# EAGLE design Pyro_Cut-Down (EAGLE 9.2.2)

## Sheet 1 of 2
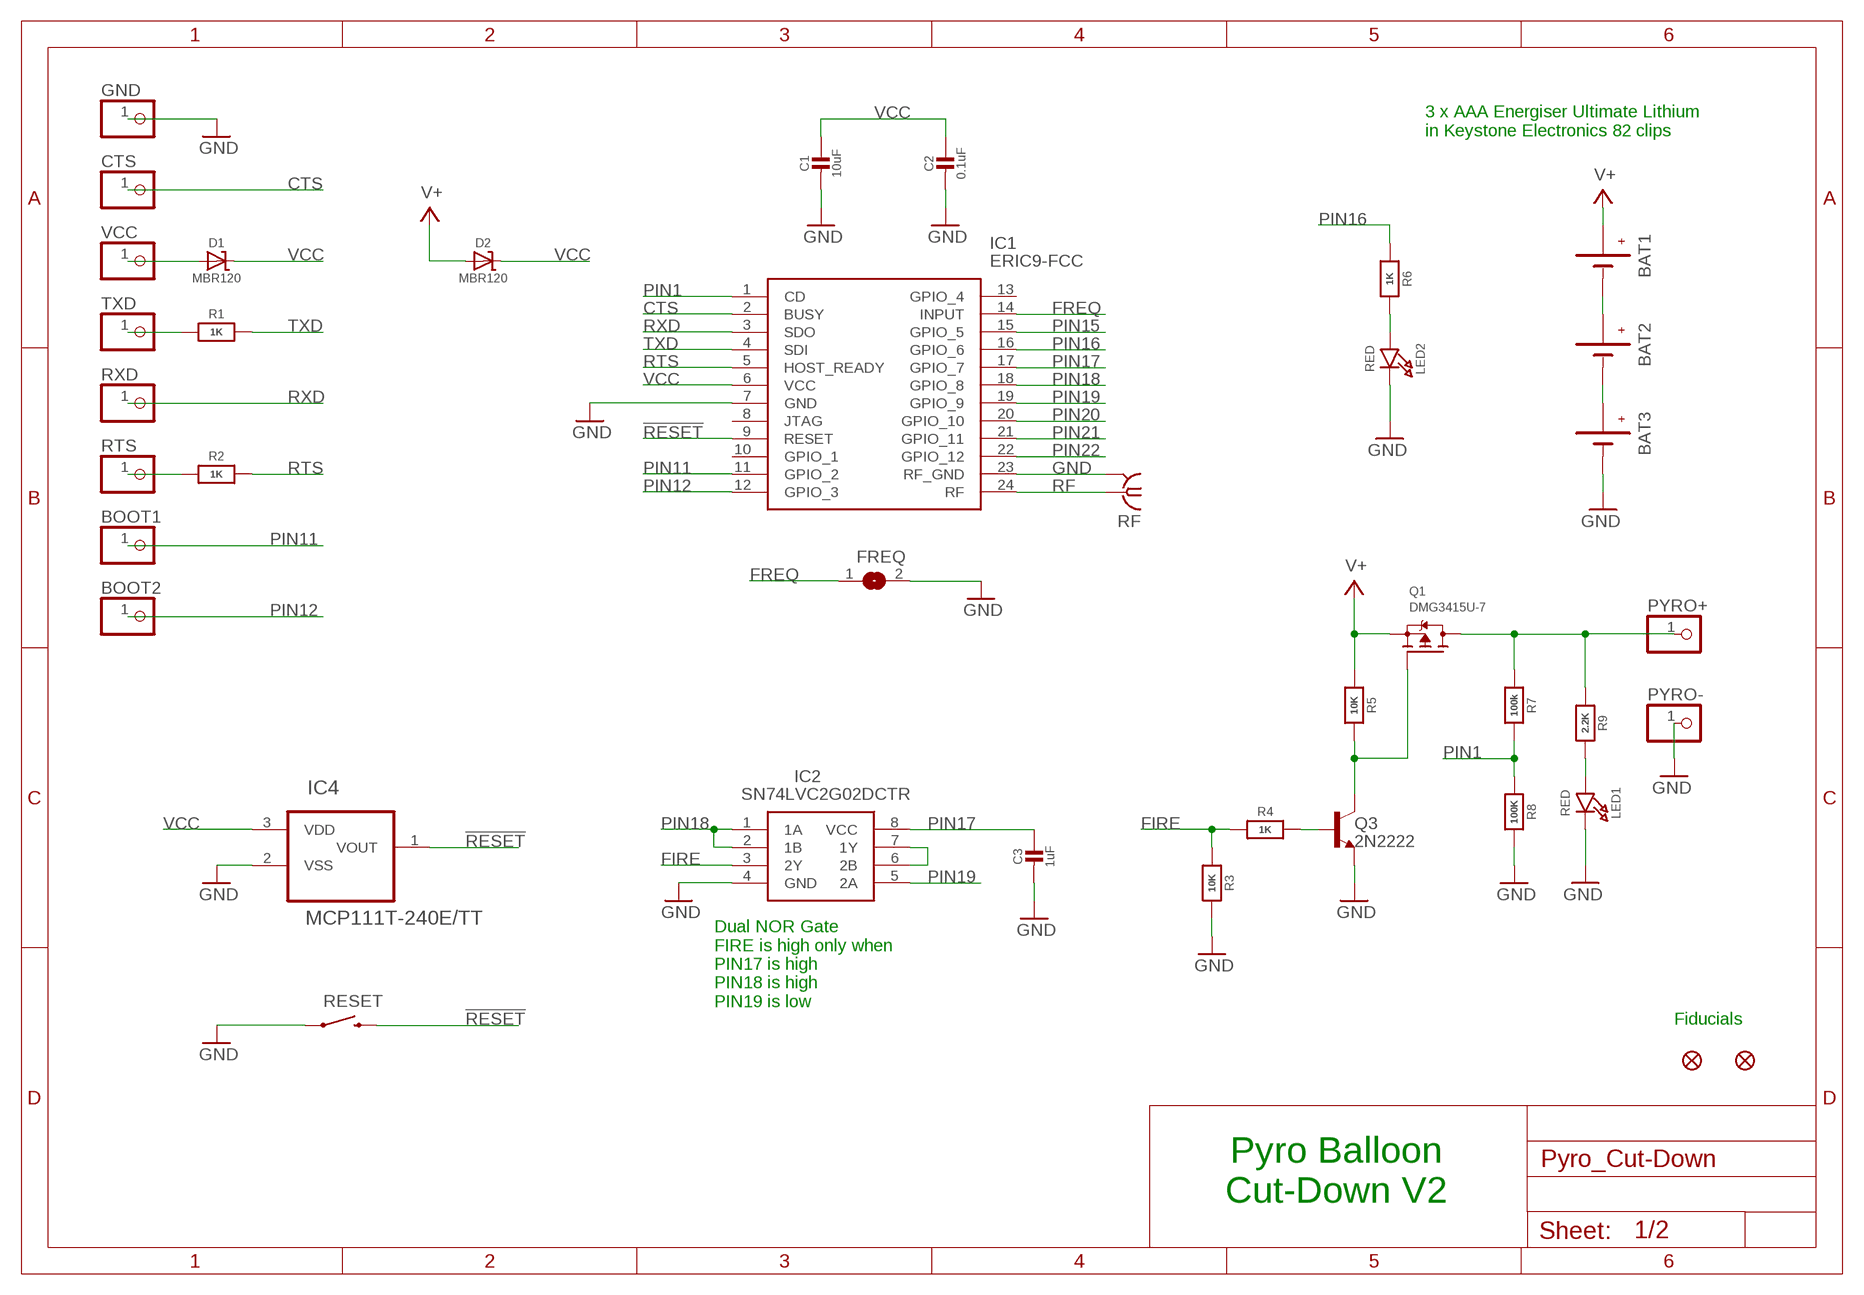
[diagram p0: schematic, sheet 1]

### Parts
BAT1  BATTERYKEYSTONE82  [BATTERY-AAA-KEYSTONE82]
BAT2  BATTERYKEYSTONE82  [BATTERY-AAA-KEYSTONE82]
BAT3  BATTERYKEYSTONE82  [BATTERY-AAA-KEYSTONE82]
BOOT1  PINHD-1X1  [1X01]
BOOT2  PINHD-1X1  [1X01]
C1  10uF  CAP_CERAMIC0805-NOOUTLINE  [0805-NO]
C2  0.1uF  CAP_CERAMIC0603_NO  [0603-NO]
C3  1uF  CAP_CERAMIC0603_NO  [0603-NO]
CTS  PINHD-1X1  [1X01]
D1  MBR120  DIODE-SCHOTTKYSOD-123  [SOD-123]
D2  MBR120  DIODE-SCHOTTKYSOD-123  [SOD-123]
FD1  FIDUCIAL1X2  [FIDUCIAL-1X2]
FD2  FIDUCIAL1X2  [FIDUCIAL-1X2]
FREQ  SOLDERJUMPER  [SOLDERJUMPER_ARROW_NOPASTE]
GND  PINHD-1X1  [1X01]
IC1  ERIC9-FCC  [ERIC4]
IC2  SN74LVC2G02DCTR  [SOP65P400X130-8N]
IC4  MCP111T-240E/TT  MCP111T-270E/TT  [SOT95P237X112-3N]
LED1  RED  LED0805_NOOUTLINE  [CHIPLED_0805_NOOUTLINE]
LED2  RED  LED0805_NOOUTLINE  [CHIPLED_0805_NOOUTLINE]
PYRO+  PINHD-1X1  [1X01]
PYRO-  PINHD-1X1  [1X01]
Q1  DMG3415U-7  MOSFET-PWIDE  [SOT23-WIDE]
Q3  2N2222  MMBT2222ALT1-NPN-SOT23-BEC  [SOT23-BEC]
R1  1K  RESISTOR_0603_NOOUT  [0603-NO]
R2  1K  RESISTOR_0603_NOOUT  [0603-NO]
R3  10K  RESISTOR_0603_NOOUT  [0603-NO]
R4  1K  RESISTOR_0603_NOOUT  [0603-NO]
R5  10K  RESISTOR_0603_NOOUT  [0603-NO]
R6  1K  RESISTOR_0603_NOOUT  [0603-NO]
R7  100k  RESISTOR_0603_NOOUT  [0603-NO]
R8  100K  RESISTOR_0603_NOOUT  [0603-NO]
R9  2.2K  RESISTOR_0603_NOOUT  [0603-NO]
RESET  SWITCH-MOMENTARY-2PTH  [TACTILE-PTH]
RF  SMA-142-0711-821/826  [J502-ND-142-0711-821/826]
RTS  PINHD-1X1  [1X01]
RXD  PINHD-1X1  [1X01]
TXD  PINHD-1X1  [1X01]
VCC  PINHD-1X1  [1X01]

### Nets
!RESET: IC1.9(RESET) IC4.1(VOUT) RESET.3 ; also sheet 2
CTS: CTS.1 IC1.2(BUSY)
FIRE: IC2.3(2Y) R3.1 R4.1
FREQ: FREQ.1 IC1.14(INPUT)
GND: BAT3.GND@1(-) BAT3.GND@2(-) C1.2 C2.2 C3.2 FREQ.2 GND.1 IC1.7(GND) IC1.23(RF_GND) IC2.4(GND) IC4.2(VSS) LED1.C LED2.C PYRO-.1 Q3.E R3.2 R8.2 RESET.1 RF.G@1 RF.G@2 RF.G@3 RF.G@4 ; also sheet 2
N$1: BAT2.GND@1(-) BAT2.GND@2(-) BAT3.PWR@1(+) BAT3.PWR@2(+)
N$2: LED2.A R6.2
N$3: BAT1.GND@1(-) BAT1.GND@2(-) BAT2.PWR@1(+) BAT2.PWR@2(+)
N$4: LED1.A R9.2
N$5: R1.1 TXD.1
N$6: IC2.6(2B) IC2.7(1Y)
N$7: R2.1 RTS.1
N$9: D1.A VCC.1
N$19: Q1.1(G) Q3.C R5.2
N$20: Q3.B R4.2
PIN1: IC1.1(CD) R7.2 R8.1
PIN11: BOOT1.1 IC1.11(GPIO_2)
PIN12: BOOT2.1 IC1.12(GPIO_3)
PIN15: IC1.15(GPIO_5) ; also sheet 2
PIN16: IC1.16(GPIO_6) R6.1
PIN17: C3.1 IC1.17(GPIO_7) IC2.8(VCC)
PIN18: IC1.18(GPIO_8) IC2.1(1A) IC2.2(1B)
PIN19: IC1.19(GPIO_9) IC2.5(2A)
PIN20: IC1.20(GPIO_10) ; also sheet 2
PIN21: IC1.21(GPIO_11) ; also sheet 2
PIN22: IC1.22(GPIO_12)
PYRO: PYRO+.1 Q1.3(D) R7.1 R9.1
RF: IC1.24(RF) RF.1
RTS: IC1.5(HOST_READY) R2.2
RXD: IC1.3(SDO) RXD.1
TXD: IC1.4(SDI) R1.2
V+: BAT1.PWR@1(+) BAT1.PWR@2(+) D2.A Q1.2(S) R5.1
VCC: C1.1 C2.1 D1.C D2.C IC1.6(VCC) IC4.3(VDD) ; also sheet 2
Unconnected: IC1.8(JTAG) IC1.10(GPIO_1) IC1.13(GPIO_4)

### Notes on the sheet
- 3 x AAA Energiser Ultimate Lithium
  in Keystone Electronics 82 clips
- Dual NOR Gate
  FIRE is high only when
  PIN17 is high
  PIN18 is high
  PIN19 is low
- Fiducials
- Pyro Balloon
  Cut-Down V2

## Sheet 2 of 2
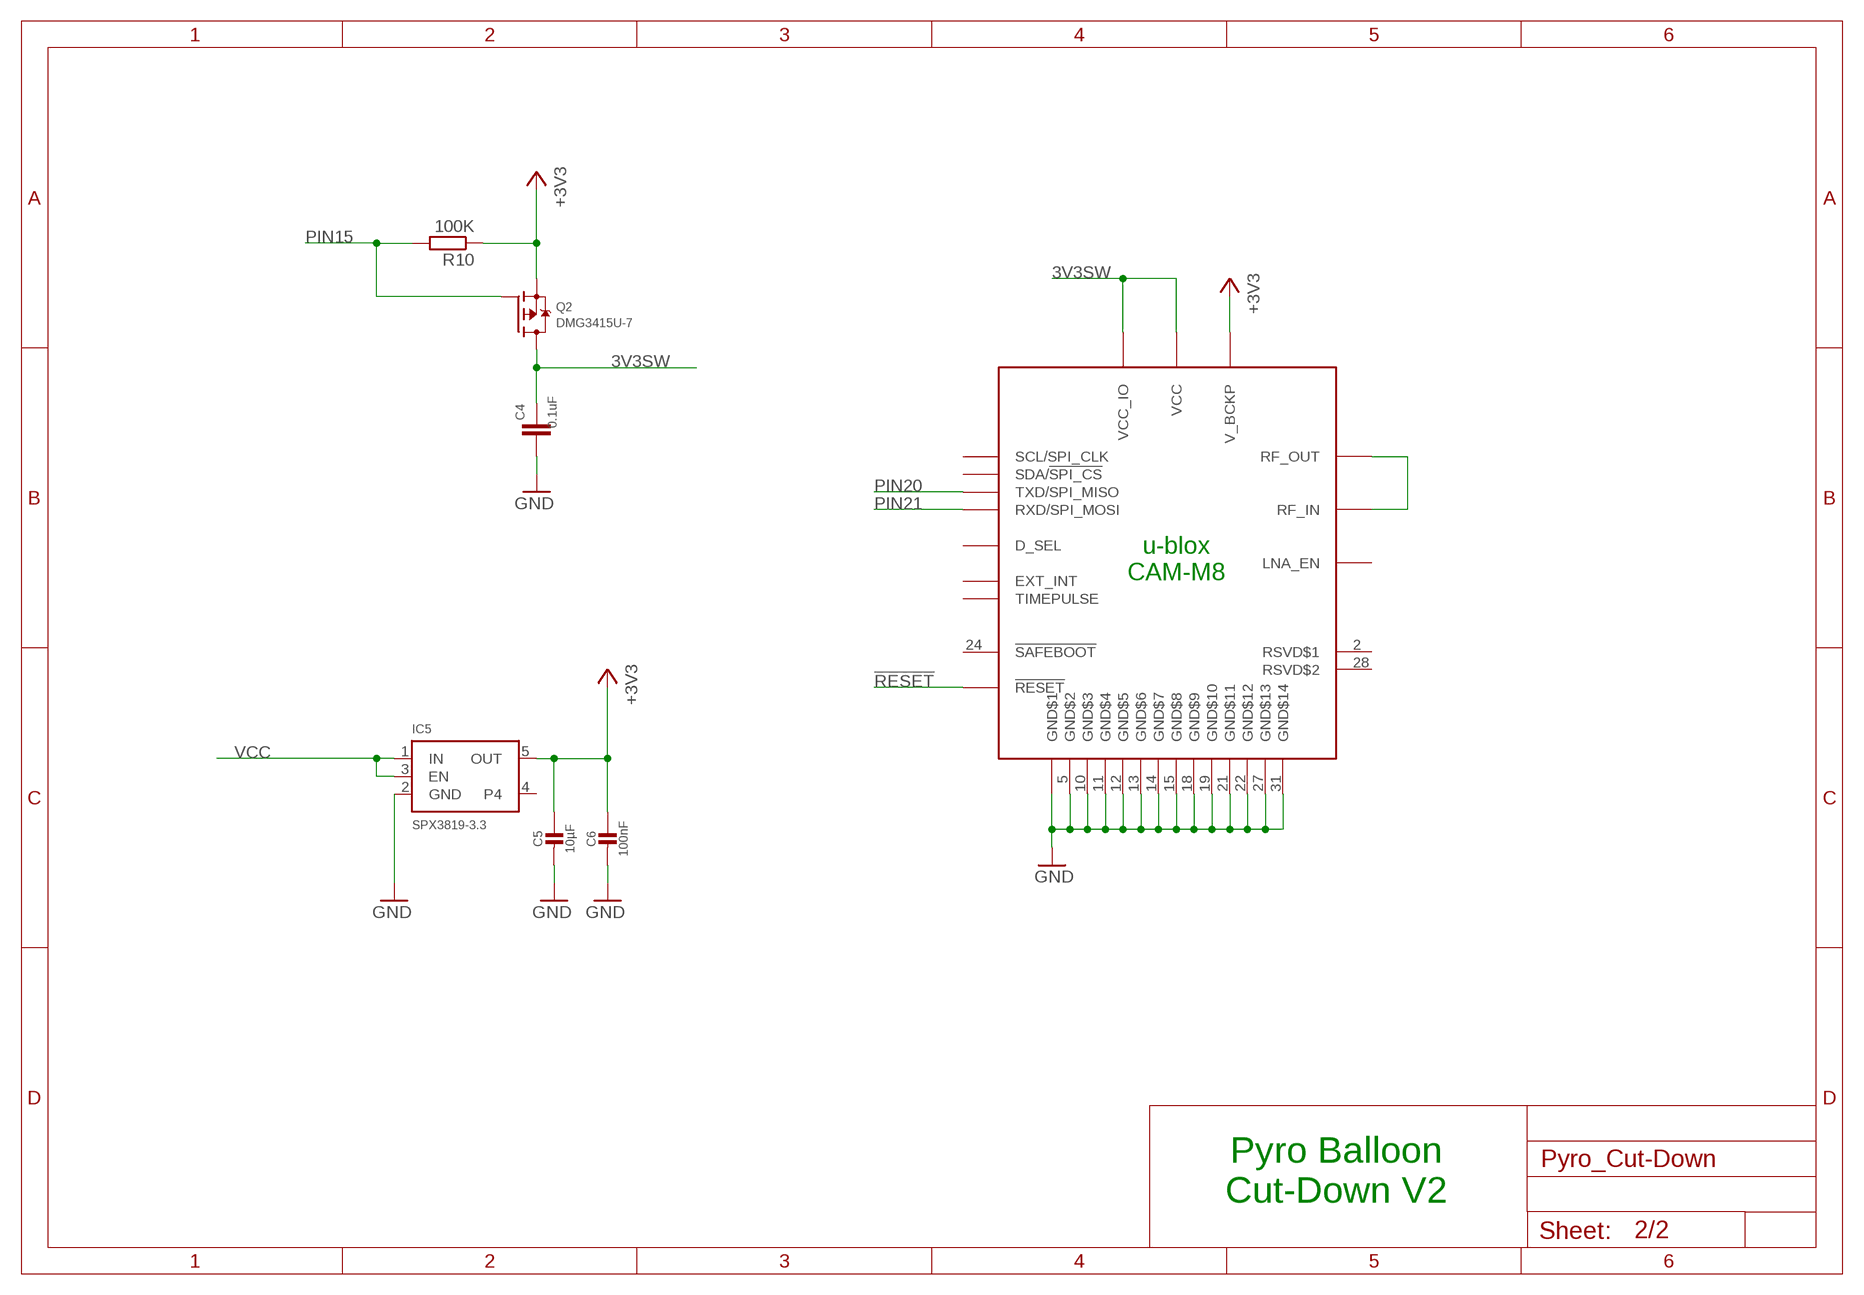
[diagram p1: schematic, sheet 2]

### Parts
C4  0.1uF  C-EUC0603  [C0603]
C5  10µF  CAP_CERAMIC0805-NOOUTLINE  [0805-NO]
C6  100nF  CAP_CERAMIC0603_NO  [0603-NO]
IC3  CAM-M8  [CAM-M8]
IC5  SPX3819-3.3  VREG_SOT23-5  [SOT23-5]
Q2  DMG3415U-7  MOSFET-PWIDE  [SOT23-WIDE]
R10  100K  R-EU_R0603  [R0603]

### Nets
3V3SW: C4.1 IC3.1(VCC_IO) IC3.9(VCC) Q2.3(D)
!RESET: IC3.23(!RESET) ; also sheet 1
+3V3: C5.1 C6.1 IC3.8(V_BCKP) IC5.5(OUT) Q2.2(S) R10.1
GND: C4.2 C5.2 C6.2 IC3.4(GND$1) IC3.5(GND$2) IC3.10(GND$3) IC3.11(GND$4) IC3.12(GND$5) IC3.13(GND$6) IC3.14(GND$7) IC3.15(GND$8) IC3.18(GND$9) IC3.19(GND$10) IC3.21(GND$11) IC3.22(GND$12) IC3.27(GND$13) IC3.31(GND$14) IC5.2(GND) ; also sheet 1
N$8: IC3.16(RF_OUT) IC3.17(RF_IN)
PIN15: Q2.1(G) R10.2 ; also sheet 1
PIN20: IC3.25(TXD/SPI_MISO) ; also sheet 1
PIN21: IC3.26(RXD/SPI_MOSI) ; also sheet 1
VCC: IC5.1(IN) IC5.3(EN) ; also sheet 1
Unconnected: IC3.2(RSVD$1) IC3.3(SDA/!SPI_CS) IC3.6(SCL/SPI_CLK) IC3.7(EXT_INT) IC3.20(D_SEL) IC3.24(!SAFEBOOT) IC3.28(RSVD$2) IC3.29(TIMEPULSE) IC3.30(LNA_EN) IC5.4

### Notes on the sheet
- u-blox
  CAM-M8
- Pyro Balloon
  Cut-Down V2

## Library data of the parts
BAT1-BAT3 = SparkFun-Electromechanical:BATTERY: Battery Holders Various common sizes : AA, AAA, 18650 (PRT-12895), 20mm coin cell and 12mm coin cell. 20MM_4LEGS, BATT-10373
BOOT1 BOOT2 CTS GND PYRO+ PYRO- RTS RXD TXD VCC = adafruit:PINHD-1X1: Pin header 1x1 for 0.1" spacing With round pins
C1-C3 C5 C6 = microbuilder:CAP_CERAMIC: Ceramic Capacitors For new designs, use the packages preceded by an '_' character since they are more reliable: The following footprints should be used on most boards: _0402 - Standard footprint for regular board layouts _0603 - Standard footprint for regular board layouts _0805 - Standard footprint for regular board layouts _1206 - Standard footprint for regular board layouts For extremely tight-pitch boards where space is at a premium, the following 'micro-pitch' footprints can be used (smaller pads, no silkscreen outline, etc.): _0402MP - Micro-pitch footprint for very dense/compact boards _0603MP - Micro-pitch footprint for very dense/compact boards _0805MP - Micro-pitch footprint for very dense/compact boards _1206MP - Micro-pitch footprint for very dense/compact boards
C4 = rcl:C-EU: CAPACITOR, European symbol
D1 D2 = microbuilder:DIODE-SCHOTTKY
FD1 FD2 = SparkFun-Aesthetics:FIDUCIAL: Fiducial Alignment Points Various fiducial points for machine vision alignment.
FREQ = microbuilder:SOLDERJUMPER: SMD Solder JUMPER Solder the two pads together to create a connection, or remove the solder to break it. REFLOW - Use this footprint for solder paste and reflow ovens. WAVE - Use this footprint for hand-soldering (larger pads). CLOSED - Has a trace between the two pads to ensure it is closed by default. The trace needs to be cut to disable the jumper, and can be closed again by creating a solder bridge between the two pads.; BOM: EXCLUDE
IC1 = SamacSys_Parts:ERIC9-FCC: RF Modules Euro/US 868/915MHz Int Cont Trans RFMod Source: Datasheet <https://componentsearchengine.com/Datasheets/1/eRIC9-FCC.pdf>; ARROW_PART_NUMBER: eRIC9-FCC; DESCRIPTION: RF Modules Euro/US 868/915MHz Int Cont Trans RFMod; HEIGHT: mm; MANUFACTURER_NAME: LPRS; MANUFACTURER_PART_NUMBER: eRIC9-FCC
IC2 = SamacSys_Parts:SN74LVC2G02DCTR: DUAL 2-INPUT POSITIVE-NOR GATE Source: Datasheet <http://www.ti.com/lit/gpn/sn74lvc2g02>; ARROW_PART_NUMBER: SN74LVC2G02DCTR; ARROW_PRICE/STOCK: https://www.arrow.com/en/products/sn74lvc2g02dctr/texas-instruments; DESCRIPTION: DUAL 2-INPUT POSITIVE-NOR GATE; HEIGHT: mm; MANUFACTURER_NAME: Texas Instruments; MANUFACTURER_PART_NUMBER: SN74LVC2G02DCTR
IC3 = ubloxLib:CAM-M8: CAM-M8x: M8 Concurrent GNSS Antenna Module u-blox.com
IC4 = Microchip-MCP11:MCP11: Micropower Voltage Detector ,SOT23-3;; MPN: MCP111T-240E/TT; OC_FARNELL: 1851877; OC_NEWARK: 56J7328; PACKAGE: SOT23-3; SUPPLIER: MICROCHIP
IC5 = microbuilder:VREG_SOT23-5: SOT23-5 Fixed Voltage Regulators Part Current Out V Out V In V Dropout θJA (°C/W) TJ (°C) Digikey Part No. ADP121 150mA 3.3V 3.4-5.5V 0.09V @ 150mA -- -- ADP121-AUJZ33R7CT-ND ADP121 150mA 3.0V 3.1-5.5V 0.09V @ 150mA -- -- ADP121-AUJZ30R7CT-ND ADP122 300mA 3.3V 3.4-5.5V 0.085V @ 300mA -- -- ADP122AUJZ-3.3-R7CT-ND ADP1712 300mA 3.3V 3.5-5.5V 0.17V @ 300mA -- -- ADP1712AUJZ-3.3-R7TR-ND AP7311 (Low Cost) 150mA 3.3V 3.5-6V 0.15V @ 150mA -- -- AP7311-33WG-7DICT-ND LD39015M18R 150mA 1.8V 1.9V-5.5V 0.08V @ 100mA -- -- 497-6977-1-ND LP2985A-33DBVR 150mA 3.3V 3.3-16V 0.28V @ 150mA 206 150 296-18479-1-ND MCP1824T-3302E/OT 300mA 3.3V 3.5V-6V 0.2V @ 300mA -- -- MCP1824T-3302E/OTCT-ND MIC5205-2.5YM5 TR 150mA 2.5V 2.7-16V 0.165V @ 150mA -- -- 576-1257-2-ND MIC5205-3.0YM5 TR 150mA 3.0V 3.2V-16V 0.165V @ 150mA -- -- 576-1258-2-ND MIC5205-3.3YM5 TR 150mA 3.3V 3.5V-16V 0.165V @ 150mA -- -- 576-1259-2-ND TPS780330220 150mA 3.3V+2.2V 3.6-5.5V 250mV Max -- -- 296-23332-1-ND TDA3663/N1,135 100mA 3.3V 3.5-45V 0.18V @ 50mA -- -- 568-5343-1-ND Max operating temp can be calculated using θJA, TJ (max junction temperature), and power in watts. Set the "Maximum Ambient Temperature" until it reaches TJ ("Max Junction Temperature"), which is the absolute limit for safe use of the regulator: Heat Sink Temperature Calculator <http://www.daycounter.com/Calculators/Heat-Sink-Temperature-Calculator.phtml> For example, With 12V source into a 3.3V LP2985 and a 30mA load, we are dissipating (12V-3.3V) * 0.03A = 0.261W. With a θJA of 206 °C/W, a TJ of 150°C, and 261mW we can safely use the chip without a heat sink up to 75°C (=147.1°C Junction Temperature).
LED1 LED2 = microbuilder:LED: LED 0603 - 0603 Surface Mount Package 2mA: Green LED - Low Power (3.9mcd, 2ma, 1.7Vf) - Digikey: 475-2709-2-ND Orange LED - Low Power (9.8mcd, 2ma, 1.8Vf) - Digikey: 475-1194-2-ND Red LED - Low Power (5mcd, 2ma, 1.8Vf) - Digikey: 475-1195-2-ND Yellow LED - Low Power (7mcd, 2ma, 1.8Vf) - Digikey: 475-1196-2-ND 5mA: Blue LED - Low Power (17mcd, 5ma, 2.9Vf) - Digikey: LNJ937W8CRACT-ND 0805 - 0805 Surface Mount Package 2mA: Red LED (8.8mcd, 2mA, 1.8Vf, Clear) - Low Power [Digikey: 475-2510-1-ND] Green LED (5mcd, 2mA, 1.8Vf, Clear) - Low Power [Digikey: 475-2730-1-ND] Yellow LED (11.3mcd, 2mA, 1.8Vf, Clear) - Low Power [Digikey: 475-2555-1-ND] 20mA: Red LED (104mcd, 20mA, Diffused) - LS R976 [Digikey: 475-1278-6-ND] Red LED (12mcd, 20mA, 2.0Vf, Clear) - APT2012EC [Digikey: 754-1128-1-ND] Green LED (15mcd, 20mA, 2.2Vf, Clear) - APT2012GC [Digikey: 754-1131-1-ND] Orange LED (160mcd, 20mA, 2.1Vf, Clear) - APT2012SECK [Digikey: 754-1130-1-ND] 1206 - 1206 Surface Mount Package Green LED (26mcd, 20mA, Diffused) - LG N971 [Digikey: 475-1407-6-ND] Red LED (15mcd, 20mA, Diffused) - LH N974 [Digikey: 475-1416-6-ND] Cree - Cree High-Power Surface Mount LEDs XPEBWT-L1-0000-00D50 - White 111lm 350mA 2.9Vf 6200K 110° XTEAWT-00-0000-00000LEE3 - White 114lm 350mA 2.85Vf 5000K 115° Everlight - Everlight 45-21 Series Surface Mount LEDs 45-21/QK2C-B2832AC2CB2/2T - Warm White 2000mcd 20mA 3.25Vf 3050K 120° 45-21/LK2C-B38452C4CB2/2T - Nuetral White 2000mcd 20mA 3.25Vf 4150K 120° 45-21/LK2C-B50634C6CB2/2T - Cold White 2200mcd 20mA 3.25Vf 5650K 120° PLCC2 Reverse Mount LS T77K-J1L2-1-0-2-R18-Z - Red 11.25mcd 2mA 1.8Vf 630nm 120° LO T77K-L1M2-24-Z - Orange 19.6mcd 2mA 1.8Vf 606nm 120° LY T77K-K2M1-26-Z - Yellow 15.7mcd 2mA 1.8Vf 587nm 120°
Q1 Q2 = microbuilder:MOSFET-P: P-Channel Mosfet LEGEND VDS: Voltage Drain-Source ID: Drain Current RDS(ON): Drain-Source On-State Resistance VGS(TH): Gate-Source Threshold Voltage CISS: Drain-Source Input Capacitance SOT-23 Name VDS ID RDS(ON) VGS(TH) CISS Order Number IRLML5103 30V 760mA 600 mOhm -- 75pF @ 25V Digikey: IRLML5103PBFCT-ND IRLML6401 12V 4.3A 50 mOhm 950mV @ 250µA 830pF @ 10V Digikey: IRLML6401PBFTR-ND NTR0202PL 20V 400mA 800 mOhm 2.3V @ 250uA 70pF @ 5V Digikey: NTR0202PLT1GOSTR-ND NTR4101PT1G 20V 1.8A 85 mOhm 1.2V @ 250uA 675pF @ 10V Digikey: NTR4101PT1GOSCT-ND DMP2004K 20V 600mA 900 mOhm 1V @ 250uA 175pF @ 16V Digikey: DMP2004KDICT-ND PMV65XP 20V 3.9A 76 mOhm 950mV @ 1mA 725pF @ 20V Digikey: 568-2358-2-ND TO-252 Name VDS ID RDS(ON) VGS(TH) CISS Order Number AOD417 30V 25A 34 mOhm 3V @ 250µA 920pF @ 15V Digikey: 785-1106-2-ND
Q3 = transistor:*-NPN-: NPN Transistror BF959 corrected 2008.03.06
R1-R9 = microbuilder:RESISTOR: Resistors For new designs, use the packages preceded by an '_' character since they are more reliable: The following footprints should be used on most boards: _0402 - Standard footprint for regular board layouts _0603 - Standard footprint for regular board layouts _0805 - Standard footprint for regular board layouts _1206 - Standard footprint for regular board layouts For extremely tight-pitch boards where space is at a premium, the following 'micro-pitch' footprints can be used (smaller pads, no silkscreen outline, etc.): _0402MP - Micro-pitch footprint for very dense/compact boards _0603MP - Micro-pitch footprint for very dense/compact boards _0805MP - Micro-pitch footprint for very dense/compact boards _1206MP - Micro-pitch footprint for very dense/compact boards
R10 = rcl:R-EU_: RESISTOR, European symbol; SPICEPREFIX: R
RESET = SparkFun-Electromechanical:SWITCH-MOMENTARY-2: Various NO switches- pushbuttons, reed, etc; PROD_ID: SWCH-08441
RF = con-coax:SMA-: SMA 50 Ohm End Launch Jack Receptacle - Round Contact Johnson Components Source: www.johnsoncomponents.com .. J502-ND.pdf; MF: JOHNSON COMPONENTS; MPN: 142-0711-821; OC_FARNELL: 1019328; OC_NEWARK: 16F3627

## Board
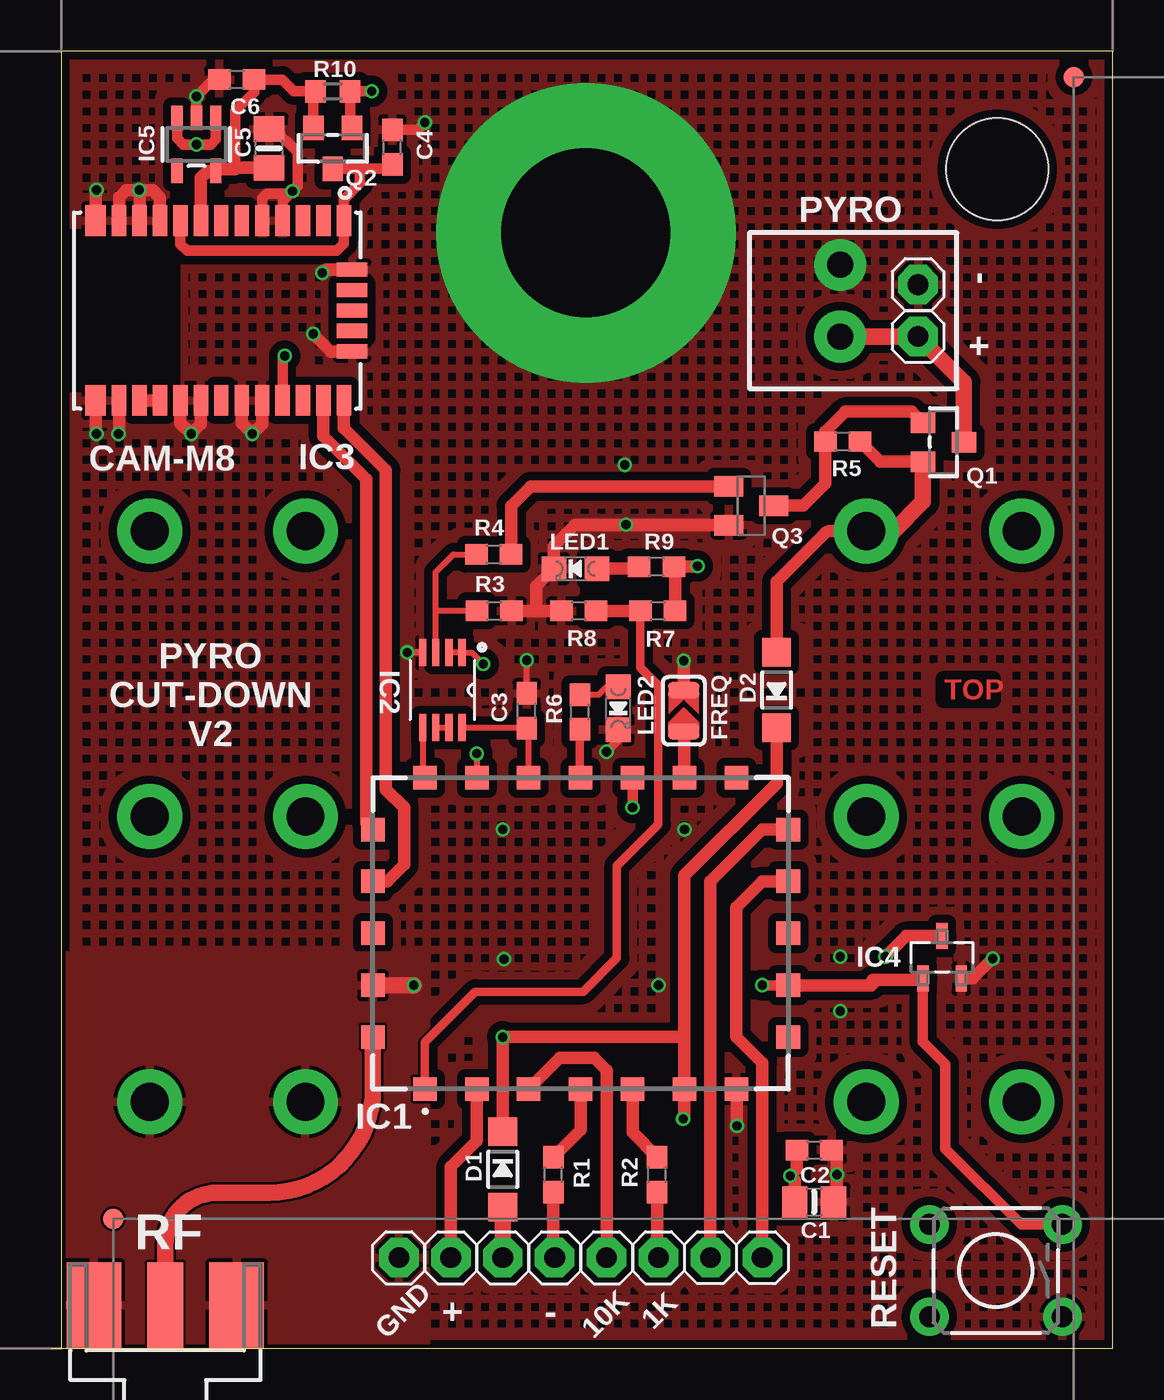
[diagram p2: board, top side]
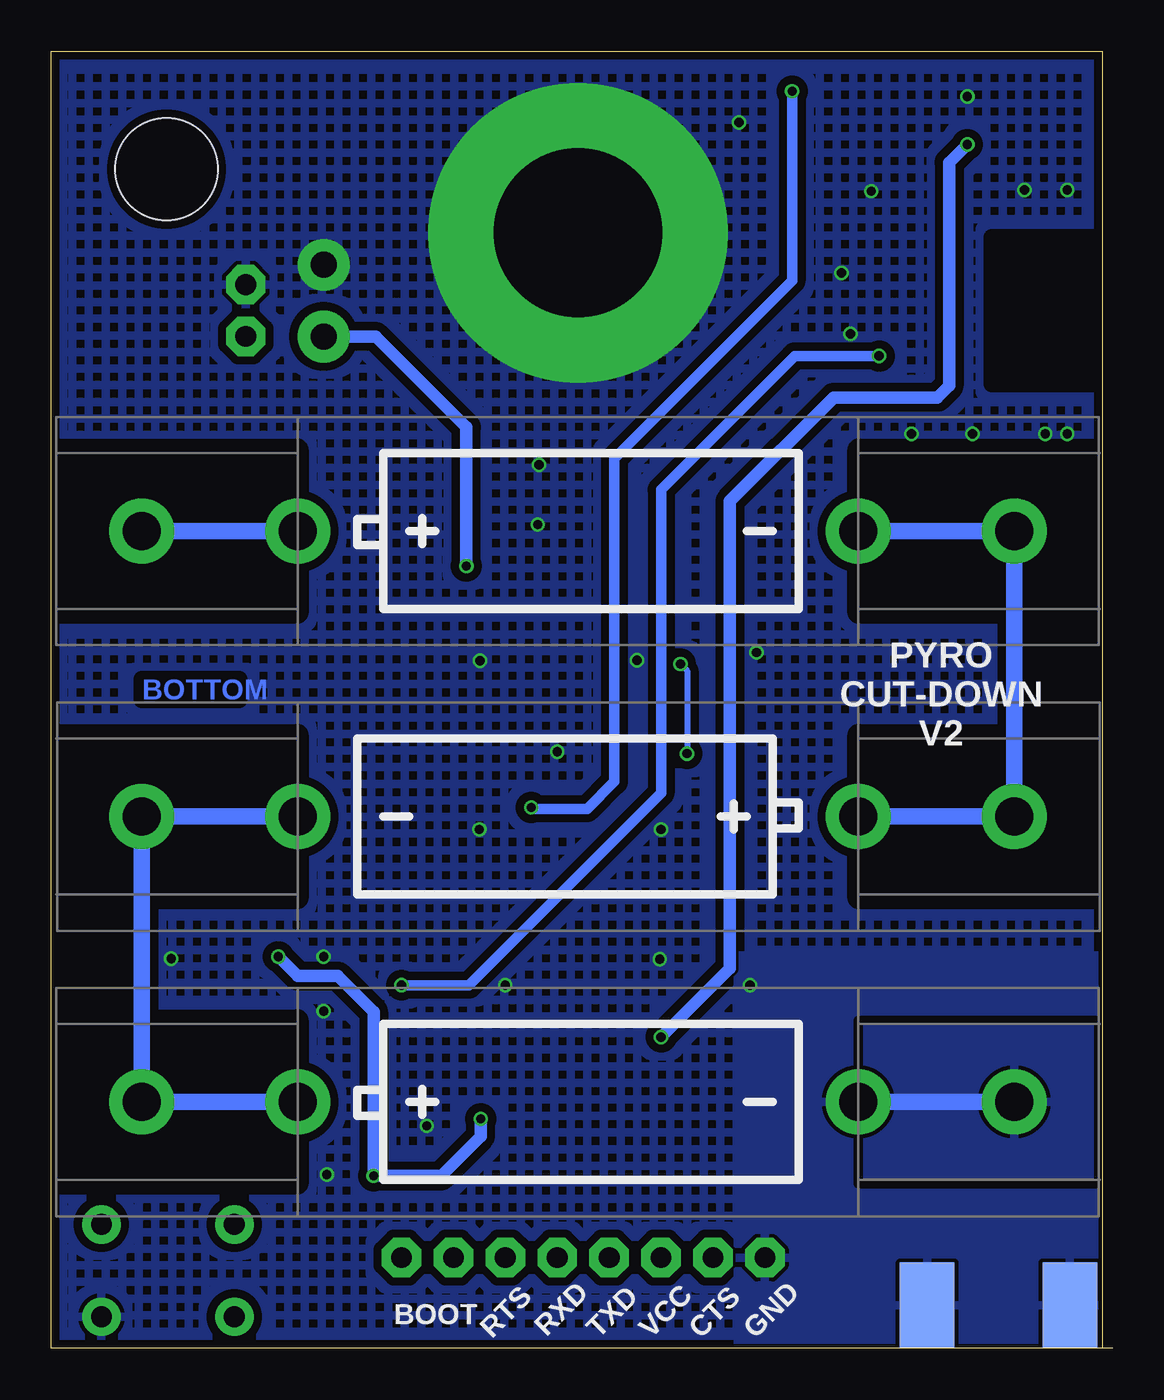
[diagram p3: board, bottom side, seen from below]

Size 51.44 x 63.5 mm. Coordinates in mm from the lower left corner, seen from the top.
Outline: 0,0 51.44,0 51.44,63.5 0,63.5 0,0
Copper layers (1*16): Top 0.018mm / dielectric 1.55mm / Bottom 0.018mm
Design rules "Multi-CB_2L_125um-Tracks_OL35um": minimum track width 0.125mm, minimum drill 0.2mm, track to track 0.125mm, track to pad 0.125mm, pad to pad 0.125mm, via to via 0.125mm, smd to smd 0mil, copper to edge 0.2mm, drill to drill 0.2mm, minimum pad ring 0.125mm, minimum via ring 0.125mm, stop-mask expansion 2mil, vias tented up to drill 0.45mm, thermal gap 0.2mm
Holes 5 mm at 45.78,57.72

### Footprints (pad centres in the part's own frame; a part is rotated, then mirrored left to right if it is on the bottom)
BATTERY-AAA-KEYSTONE82 = drill 1.854 pad 3.175: GND@1 21.336,0; GND@2 13.716,0; PWR@1 -21.336,0; PWR@2 -13.716,0
1X01 = drill 1.016 pad 1.93 octagon: 1 0,0
0805-NO = smd 1.24 x 1.5: 1 -0.95,0; 2 0.95,0
0603-NO = smd 1.1 x 1: 1 -0.85,0; 2 0.85,0
C0603 = smd 1.1 x 1: 1 -0.85,0; 2 0.85,0
SOD-123 = smd 1.4 x 1.4: A 1.85,0; C -1.85,0
FIDUCIAL-1X2 = smd 1 x 1: 1 0,0
SOLDERJUMPER_ARROW_NOPASTE = smd 0.762 x 1.524: 1 -1.016,0; 2 1.016,0
ERIC4 = smd 1.15 x 1.15: 1 -7.62,-7.62; 2 -5.08,-7.62; 3 -2.54,-7.62; 4 0,-7.62; 5 2.54,-7.62; 6 5.08,-7.62; 7 7.62,-7.62; 8 10.16,-5.08; 9 10.16,-2.54; 10 10.16,0; 11 10.16,2.54; 12 10.16,5.08; 13 7.62,7.62; 14 5.08,7.62; 15 2.54,7.62; 16 0,7.62; 17 -2.54,7.62; 18 -5.08,7.62; 19 -7.62,7.62; 20 -10.16,5.08; 21 -10.16,2.54; 22 -10.16,0; 23 -10.16,-2.54; 24 -10.16,-5.08
SOP65P400X130-8N = smd 1.321 x 0.356: 1 -1.829,0.965; 2 -1.829,0.33; 3 -1.829,-0.33; 4 -1.829,-0.965; 5 1.829,-0.965; 6 1.829,-0.33; 7 1.829,0.33; 8 1.829,0.965
CAM-M8 = smd 0.7 x 1.5: 1 -6.2,-4.4; 2 -5.2,-4.4; 3 -4.2,-4.4; 4 -3.2,-4.4; 5 -2.2,-4.4; 6 -1.2,-4.4; 7 -0.2,-4.4; 8 0.8,-4.4; 9 1.8,-4.4; 10 2.8,-4.4; 11 3.8,-4.4; 12 4.8,-4.4; 15 4.8,4.4; 16 3.8,4.4; 17 2.8,4.4; 18 1.8,4.4; 19 0.8,4.4; 20 -0.2,4.4; 21 -1.2,4.4; 22 -2.2,4.4; 23 -3.2,4.4; 24 -4.2,4.4; 25 -5.2,4.4; 26 -6.2,4.4 | smd 1 x 1.5: 13 5.95,-4.4; 14 5.95,4.4 | smd 1.5 x 0.7: 27 -6.6,2; 28 -6.6,1; 29 -6.6,0; 30 -6.6,-1; 31 -6.6,-2
SOT95P237X112-3N = smd 0.559 x 1.27: 1 -0.94,-1.041; 2 0.94,-1.041; 3 0,1.041
SOT23-5 = smd 0.55 x 1.2: 1 -0.95,-1.3; 2 0,-1.3; 3 0.95,-1.3; 4 0.95,1.3; 5 -0.95,1.3
CHIPLED_0805_NOOUTLINE = smd 1.2 x 1.2: A 0,-1.05; C 0,1.05
SOT23-WIDE = smd 1 x 1.2: 1 -0.95,-1; 2 0.95,-1; 3 0,1
SOT23-BEC = smd 1 x 1.4: B -0.95,-1.1; C 0,1.1; E 0.95,-1.1
R0603 = smd 1 x 1.1: 1 -0.85,0; 2 0.85,0
TACTILE-PTH = drill 1.016 pad 1.88: 1 -3.251,2.261; 2 3.251,2.261; 3 -3.251,-2.261; 4 3.251,-2.261
J502-ND-142-0711-821/826 = smd 4.191 x 1.778: 1 2.115,0 | smd 4.191 x 2.667: G@1 2.115,3.495; G@2 2.115,-3.495 | smd 4.191 x 2.667 bottom: G@3 2.115,3.495; G@4 2.115,-3.495

### Placement (x,y rotation side)
BAT1  25.65,40.01 0 bottom
BAT2  25.65,26.04 180 bottom
BAT3  25.65,12.06 0 bottom
BOOT1  34.29,4.45 0 top
BOOT2  31.75,4.45 0 top
C1  36.83,7.18 0 top
C2  36.83,9.72 0 top
C3  22.76,31.21 90 top
C4  16.19,58.8 90 top
C5  10.16,58.74 90 top
C6  8.57,62.1 180 top
CTS  19.05,4.45 90 top
D1  21.59,8.76 270 top
D2  34.99,32.23 90 top
FD1  49.53,62.23 0 top
FD2  2.54,6.35 0 top
FREQ  30.45,31.21 90 top
GND  16.51,4.45 90 top
IC1  25.4,20.32 0 top
IC2  18.64,32.23 270 top
IC3  7.62,50.8 180 top
IC4  43.08,19.15 0 top
IC5  6.6,58.93 180 top
LED1  25.15,38.16 90 top
LED2  27.24,31.34 180 top
PYRO+  41.91,49.53 0 top
PYRO-  41.91,52.07 0 top
Q1  43.15,44.35 270 top
Q2  13.27,58.74 180 top
Q3  33.75,41.24 270 top
R1  24.07,8.51 90 top
R2  29.15,8.51 90 top
R3  21.18,36.1 0 top
R4  21.15,38.86 0 top
R5  38.23,44.39 180 top
R6  25.37,31.15 90 top
R7  29.18,36.1 180 top
R8  25.3,36.1 180 top
R9  29.11,38.26 180 top
R10  13.27,61.53 0 top
RESET  45.72,3.81 180 top
RF  5.08,0 90 top
RTS  29.21,4.45 90 top
RXD  26.67,4.45 90 top
TXD  24.13,4.45 90 top
VCC  21.59,4.45 90 top

### Tracks (layer width: path | path; a pad name or v marks a point on that pad's centre or on a via)
3V3SW
  Top 0.508: Q2.3 14.61,57.74 | 14.61,57.74 14.61,57.02 13.82,56.24 IC3.1 13.82,54.08 13.46,53.72 6.16,53.72 5.82,54.06 IC3.9 | 14.61,57.74 15.98,57.74 C4.1
!RESET  (via drill 0.45)
  Top 0.508: v10.92,48.58 10.82,48.48 IC3.23 | v34.29,17.78 IC1.9 | IC4.1 42.15,15.01 43.24,13.91 43.24,9.78 46.95,6.07 RESET.3
  Top 0.61: IC1.9 39.62,17.78 39.69,17.84 39.69,18.03 42.08,18.03 IC4.1
  Bottom 0.508: v10.92,48.58 15.05,48.58 21.59,42.04 21.59,27.18 30.99,17.78 v34.29,17.78
+3V3
  Top 0.508: Q2.2 12.32,61.43 R10.1 11.37,61.53 10.79,62.1 C6.1 9.42,61.49 8.51,60.58 8.51,57.79 8.51,57.72
  Top 0.61: IC3.8 6.82,57.3 7.14,57.63 IC5.5 7.65,57.72 8.51,57.72 | 8.51,57.79 C5.1
CTS
  Top 0.61: CTS.1 19.05,8.89 20.32,10.16 IC1.2
FIRE
  Top 0.305: IC2.3 18.31,36.07 | 18.31,36.07 18.31,37.99 19.18,38.86 R4.1 | R3.1 18.34,36.1 18.31,36.07
FREQ
  Top 0.61: IC1.14 30.48,30.16 FREQ.1
GND  (via drill 0.45, 1.27 pad 2.54, 8.26 pad 14.66)
  Top 0.305: IC2.4 16.93,34.05 v16.92,34.07 | C3.2 v22.77,33.69
  Top 0.406: LED2.C 27.24,29.78 v26.67,29.21
  Top 0.508: IC5.2 v6.6,61.28 7.43,62.1 C6.2 | IC3.4 10.82,56.16 v11.3,56.64 | IC3.5 9.82,56.3 10.03,56.52 11.18,56.52 v11.3,56.64 | C5.2 10.42,59.69 11.56,58.55 11.56,56.9 v11.3,56.64 | C4.2 17.42,59.65 v17.78,60.01
  Top 0.61: IC1.7 33.05,12.67 v33.05,10.89 | v45.56,19.08 44.58,18.1 IC4.2 | C2.2 37.94,9.45 v37.94,8.51 37.94,7.34 C1.2 | FREQ.2 v30.45,33.66 | Q3.E 27.65,40.29 | 27.65,40.29 v27.62,40.32 | R3.2 23.24,36.1 | 23.24,36.1 R8.2 | 23.24,36.1 23.24,37.31 LED1.C 24.1,39.27 25.12,40.29 27.65,40.29 | IC3.14 1.67,44.81 v1.71,44.77 | IC3.15 2.82,44.79 v2.79,44.77 | IC3.18 5.82,45.3 v6.35,44.77 6.82,45.24 IC3.19 | IC3.21 8.82,45.28 v9.34,44.77 9.82,45.25 IC3.22 | IC3.13 1.67,56.66 v1.71,56.71 | IC3.11 3.82,56.7 | 3.82,56.7 v3.81,56.71 | IC3.12 2.82,56.35 3.17,56.7 3.82,56.7 | IC3.10 4.82,56.33 4.46,56.7 3.82,56.7 | IC3.27 13.18,48.8 v12.32,49.66 | IC3.31 12.92,52.8 v12.76,52.64
  Top 0.813: IC1.23 v17.24,17.78
  Bottom 0.813: BAT3.GND@2 BAT3.GND@1
  other vias: 25.65,54.61 38.1,53.04 21.59,25.4 30.48,25.4 21.65,19.05 29.21,17.78 38.1,19.18 38.1,16.51 27.56,43.24
  pour Bottom (isolate 0.406, rank 2, hatched): 0,0 0,45.72 0,59.05 0,63.5 46.99,63.5 51.44,63.5 51.44,0
  pour Top (isolate 0.406, rank 2, hatched): 0,0 0,45.72 0,59.05 0,63.5 46.99,63.5 51.44,63.5 51.44,0
  pour Top (isolate 0.102): 0,0 0,19.24 17.84,19.24 17.84,0
  pour Bottom (isolate 0.102): 0,0 0,19.24 17.84,19.24 17.84,0
N$1
  Bottom 0.813: BAT3.PWR@2 BAT3.PWR@1 BAT2.GND@1 BAT2.GND@2
N$2
  Top 0.305: R6.2 26.28,32 26.67,32.39 LED2.A
N$3
  Bottom 0.813: BAT2.PWR@2 BAT2.PWR@1 BAT1.GND@1 BAT1.GND@2
N$4
  Top 0.61: LED1.A 28.17,38.16 R9.2
N$5
  Top 0.61: TXD.1 24.07,4.51 R1.1
N$6
  Top 0.305: IC2.6 IC2.7
N$7
  Top 0.61: RTS.1 29.15,4.51 R2.1
N$8
  Top 0.61: IC3.17 IC3.16
N$9
  Top 0.813: VCC.1 D1.A
N$19
  Top 0.61: Q1.1 41.61,45.85 38.35,45.85 37.38,44.87 R5.2 37.38,42.33 36.29,41.24 Q3.C
N$20
  Top 0.61: Q3.B 22.95,42.19 22,41.24 R4.2
PIN1
  Top 0.406: R7.2 28.33,33.33 29.21,32.45 29.21,25.65 27.18,23.62 27.18,19.11 25.53,17.46 20.26,17.46 17.78,14.99 IC1.1
  Top 0.61: R8.1 R7.2
PIN11
  Top 0.61: BOOT1.1 34.29,13.97 33.02,15.24 33.02,21.59 34.29,22.86 IC1.11
PIN12
  Top 0.61: BOOT2.1 31.75,22.86 34.29,25.4 IC1.12
PIN15  (via drill 0.45)
  Top 0.508: Q2.1 14.12,59.84 R10.2 v15.18,61.53 | v27.94,26.48 IC1.15
  Bottom 0.508: v15.18,61.53 15.18,52.26 23.88,43.56 23.88,27.75 25.21,26.42 27.88,26.42 v27.94,26.48
PIN16
  Top 0.406: IC1.16 25.37,27.97 R6.1
PIN17
  Top 0.305: IC2.8 22.73,30.4 | 22.73,30.4 C3.1 | IC1.17 22.86,30.27 22.73,30.4
PIN18  (via drill 0.45)
  Top 0.305: IC2.2 IC2.1 20.08,34.05 v20.64,33.5 | v20.32,29.11 IC1.18
  Bottom 0.305: v20.64,33.5 20.32,33.18 v20.32,29.11
PIN19
  Top 0.305: IC2.5 17.67,28.05 IC1.19
PIN20
  Top 0.61: IC1.20 14.92,25.72 14.92,42.55 12.82,44.65 IC3.25
PIN21
  Top 0.61: IC1.21 15.94,22.86 16.76,23.69 16.76,26.48 15.88,27.37 15.88,42.99 13.82,45.04 IC3.26
PYRO  (via drill 0.45, 1.27 pad 2.54)
  Top 0.61: R7.1 30.03,38.2 R9.1 31.08,38.26 v31.11,38.29
  Top 0.813: Q1.3 44.15,47.29 PYRO+.1 v38.1,49.53
  Bottom 0.61: v31.11,38.29 31.11,45.09 35.56,49.53 v38.1,49.53
RF
  Top 0.813: IC1.24 15.24,12.7 arc-90 10.16,7.62 7.62,7.62 arc90 5.08,5.08 RF.1
RTS
  Top 0.61: R2.2 27.94,10.57 IC1.5
RXD
  Top 0.61: IC1.3 24.38,14.22 26.07,14.22 26.67,13.62 RXD.1
TXD
  Top 0.61: R1.2 25.4,10.69 IC1.4
V+
  Top 0.61: Q1.2 40.06,43.41 R5.1 | BAT1.PWR@2 37.56,40.01 37.4,39.94 34.99,37.53 D2.A
  Top 0.813: BAT1.PWR@2 40.61,40.01 40.66,39.97 42.15,41.45 Q1.2
  Bottom 0.813: BAT1.PWR@2 BAT1.PWR@1
VCC  (via drill 0.45)
  Top 0.508: IC5.3 5.65,59.24 5.97,58.93 v6.6,58.93 7.3,58.93 7.55,59.18 IC5.1
  Top 0.61: D1.C v21.59,15.24 30.45,15.24 30.48,15.27 | C1.1 35.88,8.22 v35.66,8.45 35.98,8.77 C2.1 | v30.42,11.24 30.48,11.3 IC1.6 30.48,15.27 | D2.C 34.99,27.65 30.48,23.15 30.48,15.27 | IC4.3 41.33,20.19 v40.32,19.18
  Bottom 0.61: v30.42,11.24 30.42,10.38 32.35,8.45 v35.66,8.45 35.66,16.48 37.4,18.22 39.37,18.22 v40.32,19.18 | v6.6,58.93 7.49,58.04 7.49,47.12 8.06,46.55 13.14,46.55 18.22,41.47 18.22,18.61 v21.59,15.24

### Text on the board
Top: TOP
Bottom: BOTTOM
tPlace: PYRO | - | + | PYRO / CUT-DOWN / V2 | + | - | 1K | GND | 10K
bPlace: PYRO / CUT-DOWN / V2 | BOOT